# Altium schematic sheet 5V_SIGNAL_BULKHEAD.SchDoc
size A4
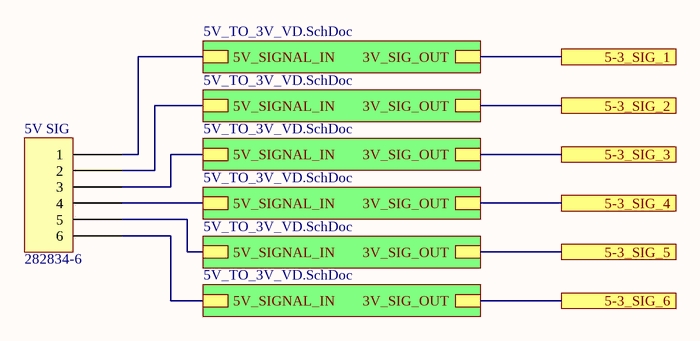
[diagram p0: 5V_SIGNAL_BULKHEAD.SchDoc]

## Parts
5V_SIG  282834-6  [TE 282834-6]

## Sub-sheets
Designator = 5V_TO_3V_VD.SchDoc: 5V_SIGNAL_IN, 3V_SIG_OUT
Designator = 5V_TO_3V_VD.SchDoc: 5V_SIGNAL_IN, 3V_SIG_OUT
Designator = 5V_TO_3V_VD.SchDoc: 5V_SIGNAL_IN, 3V_SIG_OUT
Designator = 5V_TO_3V_VD.SchDoc: 5V_SIGNAL_IN, 3V_SIG_OUT
Designator = 5V_TO_3V_VD.SchDoc: 5V_SIGNAL_IN, 3V_SIG_OUT
Designator = 5V_TO_3V_VD.SchDoc: 5V_SIGNAL_IN, 3V_SIG_OUT

## Ports
5-3_SIG_1, 5-3_SIG_2, 5-3_SIG_3, 5-3_SIG_4, 5-3_SIG_5, 5-3_SIG_6

## Nets
5-3_SIG_1: port 5-3_SIG_1, sheet Designator/3V_SIG_OUT
5-3_SIG_2: port 5-3_SIG_2, sheet Designator/3V_SIG_OUT
5-3_SIG_3: port 5-3_SIG_3, sheet Designator/3V_SIG_OUT
5-3_SIG_4: port 5-3_SIG_4, sheet Designator/3V_SIG_OUT
5-3_SIG_5: port 5-3_SIG_5, sheet Designator/3V_SIG_OUT
5-3_SIG_6: port 5-3_SIG_6, sheet Designator/3V_SIG_OUT
Net5V_SIG_1: 5V_SIG.1 ; sheet Designator/5V_SIGNAL_IN
Net5V_SIG_2: 5V_SIG.2 ; sheet Designator/5V_SIGNAL_IN
Net5V_SIG_3: 5V_SIG.3 ; sheet Designator/5V_SIGNAL_IN
Net5V_SIG_4: 5V_SIG.4 ; sheet Designator/5V_SIGNAL_IN
Net5V_SIG_5: 5V_SIG.5 ; sheet Designator/5V_SIGNAL_IN
Net5V_SIG_6: 5V_SIG.6 ; sheet Designator/5V_SIGNAL_IN

## Library data of the parts
5V_SIG = 282834-6: TERM BLK 6P SIDE ENT 2.54MM PCB; Manufacturer: TE Connectivity AMP Connectors; Current: 10A; Mating Orientation: Horizontal with Board; Number of Levels: 1; Pitch: 0.100" (2.54mm); Positions Per Level: 6; Voltage: 150V; Wire Gauge: 16-30 AWG; Wire Termination: Screw - Rising Cage Clamp; Part Number: 282834-6; Color: Green; ComponentLink1Description: Datasheet; ComponentLink1URL: https://www.te.com/commerce/DocumentDelivery/DDEController?Action=srchrtrv&DocNm=282834&DocType=Customer+Drawing&DocLang=English; ComponentLink2Description: DigiKey Link; ComponentLink2URL: http://digikey.com/product-detail/en/te-connectivity-amp-connectors/282834-6/A98337-ND/1153267; LastUpdated: 2020-01-15 4:16:31 AM; Lifecycle Status: Active; Minimum Order: 1; Mounting Type: Through Hole; Packaging: Bulk; Part Status: Active; Price: 4.72; Series: Buchanan; Supplier 1: DigiKey; Supplier Part Number 1: A98337-ND